# EAGLE design BLDCBoard (EAGLE 5.10)
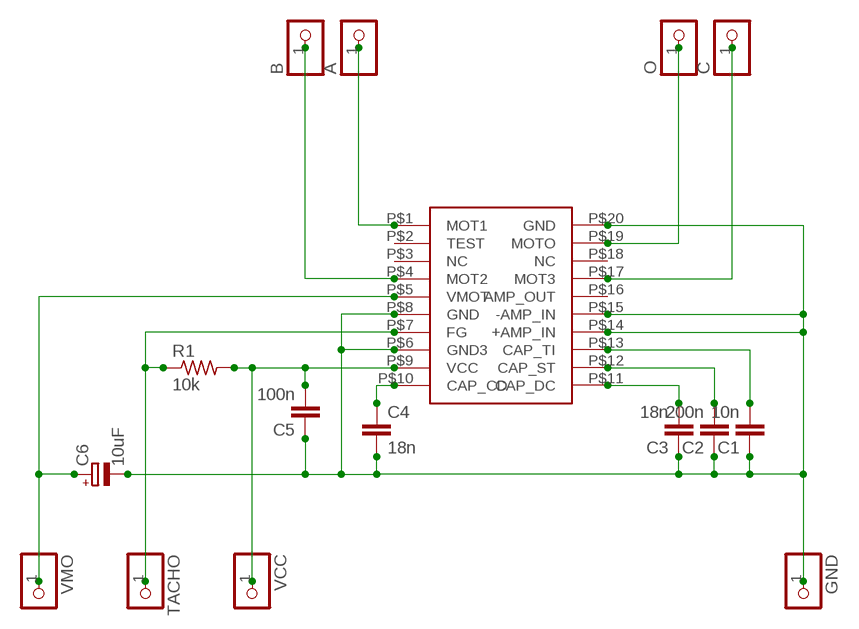
[diagram p0: schematic, sheet 1]

## Parts
A  PINHD-1X1  [1X01]
B  PINHD-1X1  [1X01]
C  PINHD-1X1  [1X01]
C1  10n  C-EUC0805  [C0805]
C2  200n  C-EUC0805  [C0805]
C3  18n  C-EUC0805  [C0805]
C4  18n  C-EUC0805  [C0805]
C5  100n  C-EUC0805  [C0805]
C6  10uF  CPOL-EUSMCD  [SMC_D]
GND  PINHD-1X1  [1X01]
IC1  TDA5144  [SO20W]
O  PINHD-1X1  [1X01]
R1  10k  R-US_R0805  [R0805]
TACHO  PINHD-1X1  [1X01]
VCC  PINHD-1X1  [1X01]
VMO  PINHD-1X1  [1X01]

## Nets
GND: C1.1 C2.1 C3.1 C4.2 C5.1 C6.- GND.1 IC1.P$6(GND3) IC1.P$8(GND) IC1.P$14(+AMP_IN) IC1.P$15(-AMP_IN) IC1.P$20(GND)
N$1: A.1 IC1.P$1(MOT1)
N$2: B.1 IC1.P$4(MOT2)
N$3: IC1.P$19(MOTO) O.1
N$4: C.1 IC1.P$17(MOT3)
N$5: C5.2 IC1.P$9(VCC) R1.2 VCC.1
N$7: C6.+ IC1.P$5(VMOT) VMO.1
N$8: IC1.P$7(FG) R1.1 TACHO.1
N$9: C1.2 IC1.P$13(CAP_TI)
N$10: C2.2 IC1.P$12(CAP_ST)
N$11: C3.2 IC1.P$11(CAP_DC)
N$12: C4.1 IC1.P$10(CAP_CD)
Unconnected: IC1.P$2(TEST) IC1.P$3(NC) IC1.P$16(AMP_OUT) IC1.P$18(NC)

## Library data of the parts
A B C GND O TACHO VCC VMO = pinhead:PINHD-1X1: PIN HEADER
C1-C5 = rcl:C-EU: CAPACITOR, European symbol
C6 = rcl:CPOL-EU: POLARIZED CAPACITOR, European symbol
IC1 = jasons_stuff:TDA5144
R1 = rcl:R-US_: RESISTOR, American symbol

## Board
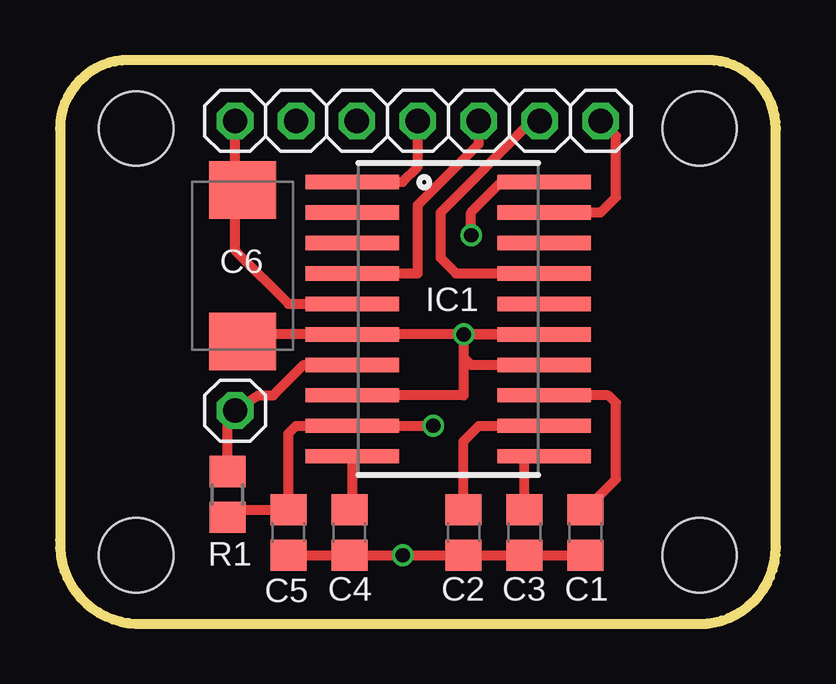
[diagram p1: board, top side]
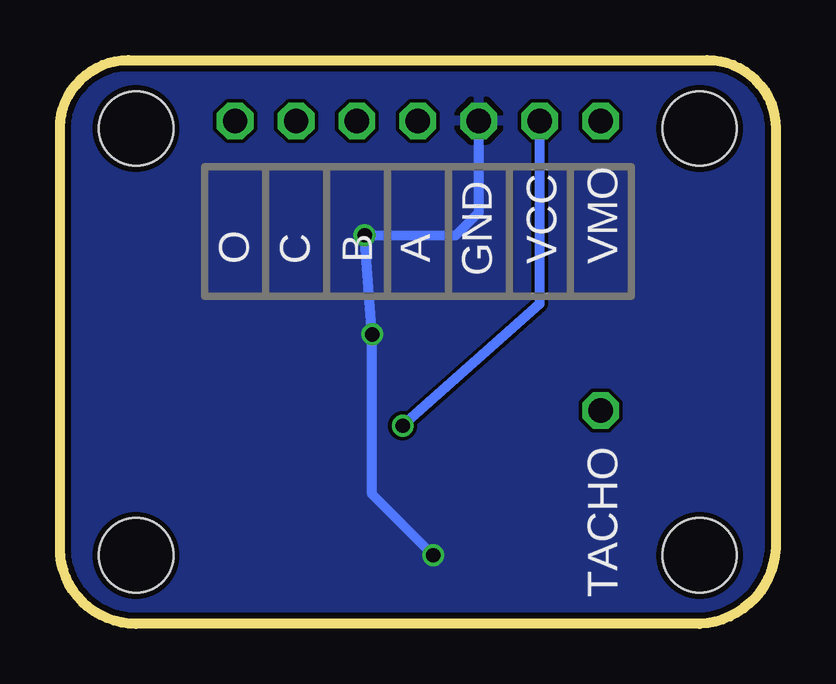
[diagram p2: board, bottom side, seen from below]

Size 29.84 x 23.49 mm. Coordinates in mm from the lower left corner, seen from the top.
Outline: 0,3.49 arc90 3.17,0 26.67,0 arc90 29.84,3.17 29.84,20.64 arc90 26.99,23.49 2.86,23.49 arc90 0,20.64 0,3.49
Copper layers (1*16): Top 0.035mm / dielectric 1.5mm / Bottom 0.035mm
Design rules "ITEADstudio_DRC": minimum track width 6mil, minimum drill 12mil, track to track 6mil, track to pad 6mil, pad to pad 6mil, via to via 6mil, smd to smd 0mil, copper to edge 10mil, drill to drill 10mil, minimum pad ring 10mil, minimum via ring 6mil, stop-mask expansion 2mil, vias tented up to drill 100mil, thermal gap 10mil
Holes 3.1 mm at 3.17,20.64 26.67,20.64 3.17,2.86 26.67,2.86

### Footprints (pad centres in the part's own frame; a part is rotated, then mirrored left to right if it is on the bottom)
1X01 = drill 1.016 octagon: 1 0,0
C0805 = smd 1.3 x 1.5: 1 -0.95,0; 2 0.95,0
SMC_D = smd 2.4 x 2.8: + -3.15,0; - 3.15,0
SO20W = smd 0.6 x 3.9: P$1 -5.715,-4; P$2 -4.445,-4; P$3 -3.175,-4; P$4 -1.905,-4; P$5 -0.635,-4; P$6 0.635,-4; P$7 1.905,-4; P$8 3.175,-4; P$9 4.445,-4; P$10 5.715,-4; P$11 5.715,4; P$12 4.445,4; P$13 3.175,4; P$14 1.905,4; P$15 0.635,4; P$16 -0.635,4; P$17 -1.905,4; P$18 -3.175,4; P$19 -4.445,4; P$20 -5.715,4
R0805 = smd 1.3 x 1.5: 1 -0.95,0; 2 0.95,0

### Placement (x,y rotation side)
A  14.92,20.95 0 top
B  17.46,20.95 0 top
C  20,20.95 0 top
C1  21.91,3.81 90 top
C2  16.83,3.81 90 top
C3  19.37,3.81 90 top
C4  12.06,3.81 270 top
C5  9.52,3.81 90 top
C6  7.62,14.92 270 top
GND  12.38,20.95 0 top
IC1  16.19,12.7 270 top
O  22.54,20.95 0 top
R1  6.98,5.4 270 top
TACHO  7.3,8.89 0 top
VCC  9.84,20.95 0 top
VMO  7.3,20.95 0 top

### Tracks (layer width: path | path; a pad name or v marks a point on that pad's centre or on a via)
GND  (via drill 0.6)
  Top 0.406: C1.1 C3.1 C2.1 v14.29,2.86 C4.2 C5.1 | IC1.P$20 18.41,18.42 17.14,17.14 v17.14,16.19 | v16.83,12.06 IC1.P$6 8.23,12.06 C6.- | v16.83,12.06 IC1.P$15 17.14,12.06 16.83,11.75 | 16.83,11.11 16.83,9.53 IC1.P$8 | 16.83,11.75 16.83,11.11 | IC1.P$14 17.14,10.8 16.83,11.11 | v16.83,12.06 16.83,11.75
  Bottom 0.406: GND.1 12.38,17.14 13.33,16.19 v17.14,16.19 v16.83,12.06 16.83,5.4 v14.29,2.86
  pour Bottom: 0.63,21.59 0.63,3.17 arc90 3.49,0.32 26.35,0.32 arc90 29.84,2.54 29.84,20.95 arc90 26.35,23.18 2.22,23.18 arc90
N$1
  Top 0.406: A.1 14.92,19.05 14.29,18.42 IC1.P$1
N$2
  Top 0.406: B.1 17.46,20 14.92,17.46 14.92,14.6 IC1.P$4
N$3
  Top 0.406: O.1 23.18,20.32 23.18,17.78 22.54,17.14 IC1.P$19
N$4
  Top 0.406: C.1 19.68,20.96 15.88,17.14 15.88,15.24 16.51,14.6 IC1.P$17
N$5  (via drill 0.6)
  Top 0.406: v15.56,8.26 IC1.P$9 9.84,8.26 9.52,7.94 C5.2 7.3,4.76 R1.2
  Bottom 0.406: VCC.1 9.84,13.33 v15.56,8.26
N$7
  Top 0.406: 7.3,17.76 C6.+ | 7.3,17.76 VMO.1 | IC1.P$5 9.52,13.33 7.3,15.56 7.3,17.76
N$8
  Top 0.406: R1.1 6.98,8.26 TACHO.1 8.25,9.53 8.89,9.53 10.16,10.8 IC1.P$7
N$9
  Top 0.406: IC1.P$13 22.86,9.53 23.18,9.21 23.18,6.03 C1.2
N$10
  Top 0.406: IC1.P$12 17.46,8.26 16.83,7.62 16.83,5.08 17.14,4.76 C2.2
N$11
  Top 0.406: IC1.P$11 19.37,6.99 C3.2
N$12
  Top 0.406: IC1.P$10 12.19,4.89 C4.1

### Text on the board
tDocu: 1 | driver rev 3 | BLDC motor | hotchk155
bDocu: 1